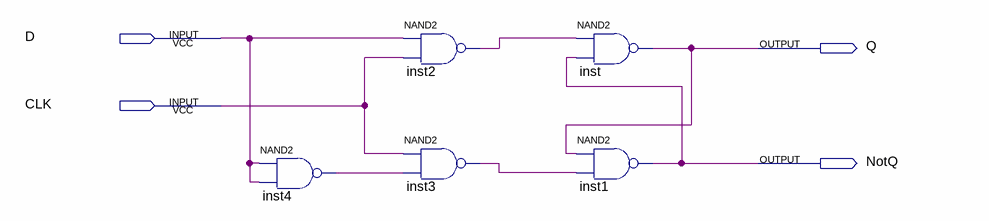
[diagram p0: schematic sheet]
// Quartus schematic SimpleDFlipFlop.bdf as structural Verilog: 5 symbols, 4 pins
module SimpleDFlipFlop (
  input  D,
  input  CLK,
  output Q,
  output NotQ
);

  wire inst2_out, inst3_out, inst4_out;

  nand inst4 (inst4_out, D, D);
  nand inst2 (inst2_out, D, CLK);
  nand inst3 (inst3_out, CLK, inst4_out);
  nand inst (Q, inst2_out, NotQ);
  nand inst1 (NotQ, Q, inst3_out);
endmodule
